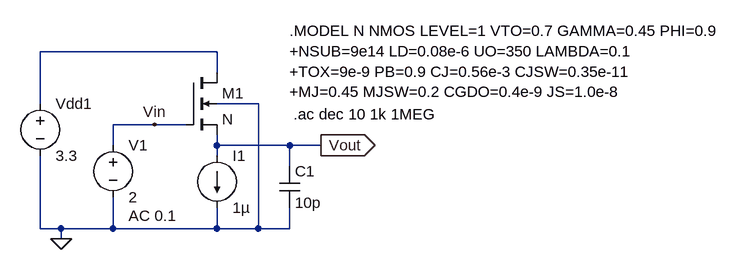
[diagram p0: schematic SourceFollower-SmallSignal.asc]
SourceFollower-SmallSignal.asc, the LTspice schematic file:
Version 4
SHEET 1 880 680
WIRE -208 -160 -480 -160
WIRE -208 -128 -208 -160
WIRE -480 -80 -480 -160
WIRE -144 -80 -208 -80
WIRE -304 -48 -368 -48
WIRE -256 -48 -304 -48
WIRE -368 -16 -368 -48
WIRE -208 -16 -208 -32
WIRE -96 -16 -208 -16
WIRE -48 -16 -96 -16
WIRE -208 0 -208 -16
WIRE -96 16 -96 -16
WIRE -480 112 -480 0
WIRE -448 112 -480 112
WIRE -368 112 -368 64
WIRE -368 112 -448 112
WIRE -208 112 -208 80
WIRE -208 112 -368 112
WIRE -144 112 -144 -80
WIRE -144 112 -208 112
WIRE -96 112 -96 80
WIRE -96 112 -144 112
WIRE -448 128 -448 112
FLAG -448 128 0
FLAG -48 -16 Vout
IOPIN -48 -16 Out
FLAG -304 -48 Vin
SYMBOL nmos4 -256 -128 R0
SYMATTR InstName M1
SYMATTR Value N
SYMATTR Value2 l=4u w=1u
SYMBOL voltage -480 -96 R0
WINDOW 123 0 0 Left 0
WINDOW 39 0 0 Left 0
SYMATTR InstName Vdd1
SYMATTR Value 3.3
SYMBOL voltage -368 -32 R0
WINDOW 123 24 124 Left 2
WINDOW 39 0 0 Left 0
SYMATTR Value2 AC 0.1
SYMATTR InstName V1
SYMATTR Value 2
SYMBOL current -208 0 R0
WINDOW 123 0 0 Left 0
WINDOW 39 0 0 Left 0
SYMATTR InstName I1
SYMATTR Value 1µ
SYMBOL cap -112 16 R0
SYMATTR InstName C1
SYMATTR Value 10p
TEXT -96 -192 Left 2 !.MODEL N NMOS LEVEL=1 VTO=0.7 GAMMA=0.45 PHI=0.9\n+NSUB=9e14 LD=0.08e-6 UO=350 LAMBDA=0.1\n+TOX=9e-9 PB=0.9 CJ=0.56e-3 CJSW=0.35e-11\n+MJ=0.45 MJSW=0.2 CGDO=0.4e-9 JS=1.0e-8
TEXT -90 -64 Left 2 !.ac dec 10 1k 1MEG

The netlist it stands for:
* SourceFollower-SmallSignal.asc
M1 N001 Vin Vout 0 N l=4u w=1u
Vdd1 N001 0 3.3
V1 Vin 0 2 AC 0.1
I1 Vout 0 1µ
C1 Vout 0 10p
.model NMOS NMOS
.model PMOS PMOS
.lib standard.mos
.MODEL N NMOS LEVEL=1 VTO=0.7 GAMMA=0.45 PHI=0.9
+NSUB=9e14 LD=0.08e-6 UO=350 LAMBDA=0.1
+TOX=9e-9 PB=0.9 CJ=0.56e-3 CJSW=0.35e-11
+MJ=0.45 MJSW=0.2 CGDO=0.4e-9 JS=1.0e-8
.ac dec 10 1k 1MEG
.backanno
.end